# EAGLE design ospi160 (EAGLE 9.6.2)
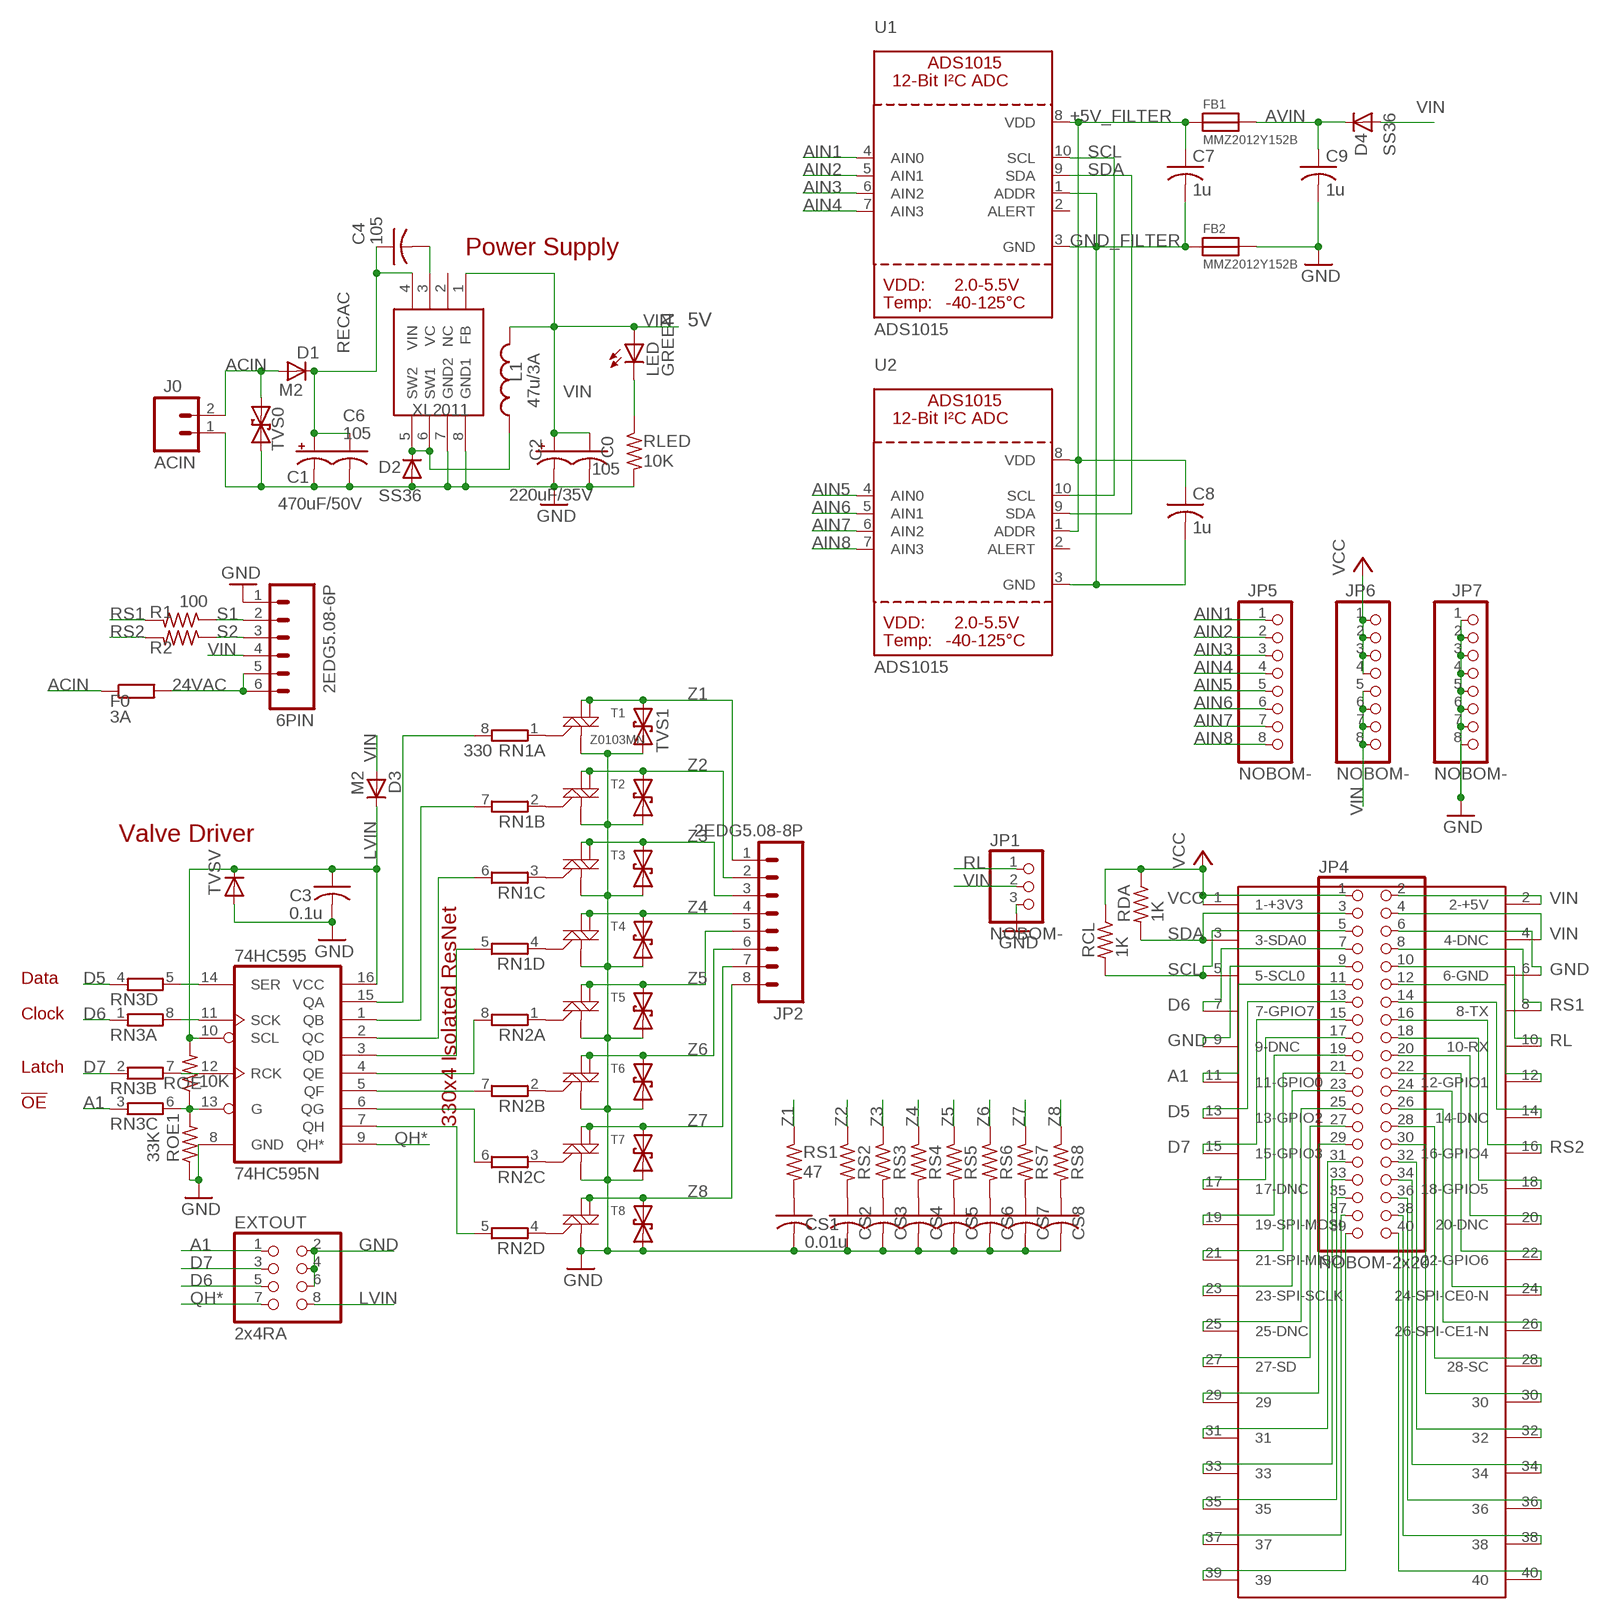
[diagram p0: schematic, sheet 1]

## Parts
6PIN  2EDG5.08-6P  M065MM  [SCREWTERMINAL-5MM-6]
74HC595  74HC595N  74LS595D  [SO16]
C0  105  C-USC0603K  [C0603K]
C1  470uF/50V  CPOL-USE5-10.5  [E5-10,5]
C2  220uF/35V  CPOL-USE3.5-8  [E3,5-8]
C3  0.1u  C-USC0603K  [C0603K]
C4  105  C-USC0603K  [C0603K]
C6  105  C-USC0603K  [C0603K]
C7  1u  C-USC0603K  [C0603K]
C8  1u  C-USC0603K  [C0603K]
C9  1u  C-USC0603K  [C0603K]
CS1  0.01u  C-USC0603K  [C0603K]
CS2  0.01u  C-USC0603K  [C0603K]
CS3  0.01u  C-USC0603K  [C0603K]
CS4  0.01u  C-USC0603K  [C0603K]
CS5  0.01u  C-USC0603K  [C0603K]
CS6  0.01u  C-USC0603K  [C0603K]
CS7  0.01u  C-USC0603K  [C0603K]
CS8  0.01u  C-USC0603K  [C0603K]
D1  M2  DIODE-DO-214AC  [DO-214AC]
D2  SS36  DIODE-SMB  [SMB]
D3  M2  DIODE-DO-214AC  [DO-214AC]
D4  SS36  DIODE-SMB  [SMB]
EXTOUT  2x4RA  PINHD-2X4/90  [2X04/90]
F0  3A  R-EU_0207/15  [0207/15]
FB1  MMZ2012Y152B  FERRITE0805  [0805]
FB2  MMZ2012Y152B  FERRITE0805  [0805]
J0  ACIN  M024MM-X  [SCREWTERMINAL-4MM-2-X]
JP1  NOBOM-  PINHD-1X3  [1X03]
JP2  2EDG5.08-8P  M085MM-8  [SCREWTERMINAL-5MM-8]
JP4  NOBOM-2x20  PINHD-2X20  [2X20]
JP5  NOBOM-  PINHD-1X8CLEANBIG  [1X08-CLEANBIG]
JP6  NOBOM-  PINHD-1X8CLEANBIG  [1X08-CLEANBIG]
JP7  NOBOM-  PINHD-1X8CLEANBIG  [1X08-CLEANBIG]
L1  47u/3A  INDUCTORYT1014  [YT1014]
LED  GREEN  LEDCHIPLED_0805  [CHIPLED_0805]
R1  100  R-US_R0603  [R0603]
R2  100  R-US_R0603  [R0603]
RCL  1K  R-US_R0603  [R0603]
RDA  1K  R-US_R0603  [R0603]
RLED  10K  R-US_R0603  [R0603]
RN1  330  4R-NEXB38V  [EXB38V]
RN2  330  4R-NEXB38V  [EXB38V]
RN3  330  4R-NEXB38V  [EXB38V]
ROE  10K  R-US_R0603  [R0603]
ROE1  33K  R-US_R0603  [R0603]
RPI  RPIB+B+  [RPIB+]
RS1  47  R-US_R0603  [R0603]
RS2  47  R-US_R0603  [R0603]
RS3  47  R-US_R0603  [R0603]
RS4  47  R-US_R0603  [R0603]
RS5  47  R-US_R0603  [R0603]
RS6  47  R-US_R0603  [R0603]
RS7  47  R-US_R0603  [R0603]
RS8  47  R-US_R0603  [R0603]
T1  Z0103MN  MAC97SOT223  [SOT223]
T2  Z0103MN  MAC97SOT223  [SOT223]
T3  Z0103MN  MAC97SOT223  [SOT223]
T4  Z0103MN  MAC97SOT223  [SOT223]
T5  Z0103MN  MAC97SOT223  [SOT223]
T6  Z0103MN  MAC97SOT223  [SOT223]
T7  Z0103MN  MAC97SOT223  [SOT223]
T8  Z0103MN  MAC97SOT223  [SOT223]
TVS0  TVSSMB  [SMB]
TVS1  SMBJ43CA  TVSSMB  [SMB]
TVS2  SMBJ43CA  TVSSMB  [SMB]
TVS3  SMBJ43CA  TVSSMB  [SMB]
TVS4  SMBJ43CA  TVSSMB  [SMB]
TVS5  SMBJ43CA  TVSSMB  [SMB]
TVS6  SMBJ43CA  TVSSMB  [SMB]
TVS7  SMBJ43CA  TVSSMB  [SMB]
TVS8  SMBJ43CA  TVSSMB  [SMB]
TVSV  SMBJ5.0A  DIODESMA-ALT  [SMA-DIODE_ALT]
U1  ADS1015  ADC_ADS1015  [MSOP10]
U2  ADS1015  ADC_ADS1015  [MSOP10]
XL2011  XL2011  XL2001  [SO08]

## Nets
24VAC [power]: 6PIN.5 6PIN.6 F0.2
+5V_FILTER [power]: C7.1 C8.1 FB1.1 U1.8(VDD) U2.1(ADDR) U2.8(VDD)
A1: EXTOUT.1 JP4.11 RN3.3 RPI.11(11-GPIO0)
ACIN [power]: D1.A F0.1 J0.2 TVS0.C
AIN1: JP5.1 U1.4(AIN0)
AIN2: JP5.2 U1.5(AIN1)
AIN3: JP5.3 U1.6(AIN2)
AIN4: JP5.4 U1.7(AIN3)
AIN5: JP5.5 U2.4(AIN0)
AIN6: JP5.6 U2.5(AIN1)
AIN7: JP5.7 U2.6(AIN2)
AIN8: JP5.8 U2.7(AIN3)
AVIN [power]: C9.1 D4.C FB1.2
D5: JP4.13 RN3.4 RPI.13(13-GPIO2)
D6: EXTOUT.5 JP4.7 RN3.1 RPI.7(7-GPIO7)
D7: EXTOUT.3 JP4.15 RN3.2 RPI.15(15-GPIO3)
GND [power]: 6PIN.1 74HC595.8(GND) C0.2 C1.- C2.- C3.2 C6.2 C9.2 CS1.2 CS2.2 CS3.2 CS4.2 CS5.2 CS6.2 CS7.2 CS8.2 D2.A EXTOUT.2 EXTOUT.4 EXTOUT.6 FB2.2 J0.1 JP1.3 JP4.6 JP4.9 JP7.1 JP7.2 JP7.3 JP7.4 JP7.5 JP7.6 JP7.7 JP7.8 RLED.2 ROE1.1 RPI.6(6-GND) RPI.9(9-DNC) T1.1(M1) T2.1(M1) T3.1(M1) T4.1(M1) T5.1(M1) T6.1(M1) T7.1(M1) T8.1(M1) TVS0.A TVS1.C TVS2.C TVS3.C TVS4.C TVS5.C TVS6.C TVS7.C TVS8.C TVSV.A XL2011.7(GND2) XL2011.8(GND1)
GND_FILTER [power]: C7.2 C8.2 FB2.1 U1.1(ADDR) U1.3(GND) U2.3(GND)
LVIN [power]: 74HC595.10(SCL) 74HC595.16(VCC) C3.1 D3.C EXTOUT.8 ROE.2 TVSV.C
N$1: LED.C RLED.1
N$3: RN1.1 T1.3(G)
N$4: 74HC595.5(QF) RN2.7
N$5: 74HC595.6(QG) RN2.6
N$6: RN1.2 T2.3(G)
N$7: 74HC595.7(QH) RN2.5
N$8: CS1.1 RS1.2
N$9: CS2.1 RS2.2
N$10: 74HC595.4(QE) RN2.8
N$11: 74HC595.3(QD) RN1.5
N$12: 74HC595.2(QC) RN1.6
N$13: 74HC595.1(QB) RN1.7
N$14: 74HC595.15(QA) RN1.8
N$15: RN1.3 T3.3(G)
N$16: CS3.1 RS3.2
N$17: CS4.1 RS4.2
N$18: CS5.1 RS5.2
N$19: RN1.4 T4.3(G)
N$20: CS6.1 RS6.2
N$21: RN2.1 T5.3(G)
N$22: CS7.1 RS7.2
N$23: CS8.1 RS8.2
N$24: D2.C L1.P$1 XL2011.5(SW2) XL2011.6(SW1)
N$25: C4.2 XL2011.3(VC)
N$26: RN2.2 T6.3(G)
N$27: RN2.3 T7.3(G)
N$28: RN2.4 T8.3(G)
N$33: 74HC595.14(SER) RN3.5
N$34: 74HC595.11(SCK) RN3.8
N$35: 74HC595.12(RCK) RN3.7
N$37: JP4.12 RPI.12(12-GPIO1)
N$38: JP4.14 RPI.14(14-DNC)
N$40: 74HC595.13(G) RN3.6 ROE1.2 ROE.1
N$41: JP4.23 RPI.23(23-SPI-SCLK)
N$42: JP4.25 RPI.25(25-DNC)
N$43: JP4.27 RPI.27(27-SD)
N$44: JP4.29 RPI.29
N$45: JP4.39 RPI.39
N$46: JP4.37 RPI.37
N$47: JP4.17 RPI.17(17-DNC)
N$48: JP4.19 RPI.19(19-SPI-MOSI)
N$49: JP4.21 RPI.21(21-SPI-MISO)
N$50: JP4.35 RPI.35
N$51: JP4.33 RPI.33
N$52: JP4.31 RPI.31
N$53: JP4.34 RPI.34
N$54: JP4.36 RPI.36
N$55: JP4.38 RPI.38
N$56: JP4.40 RPI.40
N$59: JP4.18 RPI.18(18-GPIO5)
N$60: JP4.20 RPI.20(20-DNC)
N$61: JP4.22 RPI.22(22-GPIO6)
N$62: JP4.24 RPI.24(24-SPI-CE0-N)
N$63: JP4.26 RPI.26(26-SPI-CE1-N)
N$64: JP4.28 RPI.28(28-SC)
N$65: JP4.30 RPI.30
N$66: JP4.32 RPI.32
QH*: 74HC595.9(QH*) EXTOUT.7
RECAC [power]: C1.+ C4.1 C6.1 D1.C XL2011.4(VIN)
RL: JP1.1 JP4.10 RPI.10(10-RX)
RS1: JP4.8 R1.2 RPI.8(8-TX)
RS2: JP4.16 R2.2 RPI.16(16-GPIO4)
S1: 6PIN.2 R1.1
S2: 6PIN.3 R2.1
SCL [i2c]: JP4.5 RCL.2 RPI.5(5-SCL0) U1.10(SCL) U2.10(SCL)
SDA [i2c]: JP4.3 RDA.2 RPI.3(3-SDA0) U1.9(SDA) U2.9(SDA)
VCC: JP4.1 JP6.1 JP6.2 JP6.3 JP6.4 RCL.1 RDA.1 RPI.1(1-+3V3)
VIN [power]: 6PIN.4 C0.1 C2.+ D3.A D4.A JP1.2 JP4.2 JP4.4 JP6.5 JP6.6 JP6.7 JP6.8 L1.P$2 LED.A RPI.2(2-+5V) RPI.4(4-DNC) XL2011.1(FB)
Z1: JP2.1 RS1.1 T1.2(M2) T1.4(M2-4) TVS1.A
Z2 [power]: JP2.2 RS2.1 T2.2(M2) T2.4(M2-4) TVS2.A
Z3 [power]: JP2.3 RS3.1 T3.2(M2) T3.4(M2-4) TVS3.A
Z4 [power]: JP2.4 RS4.1 T4.2(M2) T4.4(M2-4) TVS4.A
Z5 [power]: JP2.5 RS5.1 T5.2(M2) T5.4(M2-4) TVS5.A
Z6 [power]: JP2.6 RS6.1 T6.2(M2) T6.4(M2-4) TVS6.A
Z7 [power]: JP2.7 RS7.1 T7.2(M2) T7.4(M2-4) TVS7.A
Z8 [power]: JP2.8 RS8.1 T8.2(M2) T8.4(M2-4) TVS8.A
Unconnected: U1.2(ALERT) U2.2(ALERT) XL2011.2(NC)

## Notes on the sheet
- Power Supply
- 5V
- Valve Driver
- Data
- Clock
- Latch
- !OE
- 330x4 Isolated ResNet

## Library data of the parts
6PIN = SparkFun:M06: Header 6 Standard 6-pin 0.1" header. Use with straight break away headers (SKU : PRT-00116), right angle break away headers (PRT-00553), swiss pins (PRT-00743), machine pins (PRT-00117), and female headers (PRT-00115). Molex polarized connector foot print use with SKU : PRT-08094 with associated crimp pins and housings. NOTES ON THE VARIANTS LOCK and LOCK_LONGPADS... This footprint was designed to help hold the alignment of a through-hole component (i.e. 6-pin header) while soldering it into place. You may notice that each hole has been shifted either up or down by 0.005 of an inch from it's more standard position (which is a perfectly straight line). This slight alteration caused the pins (the squares in the middle) to touch the edges of the holes. Because they are alternating, it causes a "brace" to hold the component in place. 0.005 has proven to be the perfect amount of "off-center" position when using our standard breakaway headers. Although looks a little odd when you look at the bare footprint, once you have a header in there, the alteration is very hard to notice. Also, if you push a header all the way into place, it is covered up entirely on the bottom side. This idea of altering the position of holes to aid alignment will be further integrated into the Sparkfun Library for other footprints. It can help hold any component with 3 or more connection pins.
74HC595 = SparkFun:74*595: 8-bit SHIFT REGISTER, output latch
C0 C3 C4 C6 CS1-CS8 = adafruit:C-US: CAPACITOR, American symbol
C1 C2 = adafruit:CPOL-US: POLARIZED CAPACITOR, American symbol
C7-C9 = adafruit2013:C-US: CAPACITOR, American symbol
D1-D4 = diode:DIODE-: DIODE
EXTOUT = pinhead:PINHD-2X4: PIN HEADER
F0 = rcl:R-EU_: RESISTOR, European symbol; SPICEPREFIX: R
FB1 FB2 = microbuilder:FERRITE: Ferrite Bead 0603 MMZ1608B121C - 120 Ohm, 600mA Ferrite Chip - Digikey: 445-2164-1-ND BK1608HW121-T - 120 Ohm, 600mA Ferrite Chip - Digikey: 587-1876-2-ND 0805 HZ0805B272R-10 - 2.7K Ohm @ 100MHz, 200mA 0.8 Ohm DC Resistance - Digikey: 240-2504-1-ND (see also Murata BLM21BD272SN1L)
J0 = SparkFun:M02: Header 2 Standard 2-pin 0.1" header. Use with straight break away headers (SKU : PRT-00116), right angle break away headers (PRT-00553), swiss pins (PRT-00743), machine pins (PRT-00117), and female headers (PRT-00115). Molex polarized connector foot print use with SKU : PRT-08233 with associated crimp pins and housings.
JP1 = pinhead:PINHD-1X3: PIN HEADER
JP2 = SparkFun:M08: Header 8 Standard 8-pin 0.1" header. Use with straight break away headers (SKU : PRT-00116), right angle break away headers (PRT-00553), swiss pins (PRT-00743), machine pins (PRT-00117), and female headers (PRT-00115).
JP4 = adafruit_3:PINHD-2X20: PIN HEADER
JP5-JP7 = adafruit:PINHD-1X8: PIN HEADER
L1 = SparkFunNew:INDUCTOR: Inductors Basic Inductor/Choke - 0603 and 1206. Footprints are not proven and vary greatly between part numbers.
LED = adafruit:LED: LED OSRAM: - CHIPLED LG R971, LG N971, LY N971, LG Q971, LY Q971, LO R971, LY R971 LH N974, LH R974 LS Q976, LO Q976, LY Q976 LO Q996 - Hyper CHIPLED LW Q18S LB Q993, LB Q99A, LB R99A - SideLED LS A670, LO A670, LY A670, LG A670, LP A670 LB A673, LV A673, LT A673, LW A673 LH A674 LY A675 LS A676, LA A676, LO A676, LY A676, LW A676 LS A679, LY A679, LG A679 - Hyper Micro SIDELED® LS Y876, LA Y876, LO Y876, LY Y876 LT Y87S - SmartLED LW L88C, LW L88S LB L89C, LB L89S, LG L890 LS L89K, LO L89K, LY L89K LS L896, LA L896, LO L896, LY L896 - TOPLED LS T670, LO T670, LY T670, LG T670, LP T670 LSG T670, LSP T670, LSY T670, LOP T670, LYG T670 LG T671, LOG T671, LSG T671 LB T673, LV T673, LT T673, LW T673 LH T674 LS T676, LA T676, LO T676, LY T676, LB T676, LH T676, LSB T676, LW T676 LB T67C, LV T67C, LT T67C, LS T67K, LO T67K, LY T67K, LW E67C LS E67B, LA E67B, LO E67B, LY E67B, LB E67C, LV E67C, LT E67C LW T67C LS T679, LY T679, LG T679 LS T770, LO T770, LY T770, LG T770, LP T770 LB T773, LV T773, LT T773, LW T773 LH T774 LS E675, LA E675, LY E675, LS T675 LS T776, LA T776, LO T776, LY T776, LB T776 LHGB T686 LT T68C, LB T68C - Hyper Mini TOPLED® LB M676 - Mini TOPLED Santana® LG M470 LS M47K, LO M47K, LY M47K Source: http://www.osram.convergy.de/
R1 R2 RCL RDA RLED ROE ROE1 RS1-RS8 = adafruit2013:R-US_: RESISTOR, American symbol
RN1-RN3 = resistor-net:4R-N: Array Chip Resistor Source: RS Component / Phycomp; OC_FARNELL: unknown; OC_NEWARK: unknown
RPI = RaspberryPi:RPIB+
T1-T8 = SparkFun:MAC97: MAC97 Triac http://www.onsemi.com/pub_link/Collateral/MAC97-D.PDF
TVS0 TVS1-TVS8 = SparkFunNew:TVS
TVSV = SparkFunNew:DIODE: Diode These are standard reverse protection diodes and small signal diodes. SMA package can handle up to about 1A. SOD-323 can handle about 200mA. What the SOD-323 package when ordering, there are some mfgs out there that are 5-pin packages.
U1 U2 = microbuilder:ADC_ADS1015: ADS1015 - 12-bit 4-Channel I2C ADC with Internal PGA VDD: 2.0-5.5V Sampling Rate: 3.3ksps Gain Settings: 2/3, 1, 2, 4, 8, 16 I2C Address: ADDR low = 1001000x, ADDR high = 1001001x Internal Comparator The ADS1015 includes an internal comparator that can be set to output a high-level on ALERT when the conversion results exceeeds a pre-defined upper level, and will deassert itself when the level falls below a pre-defined lower threshold level. It can also be set to windowed mode where the ALERT pin will be asserted if the data exceeds the upper threshold or falls below the lower threshold.
XL2011 = adafruit:XL2001

## Net classes
0 default: width 0.178 mm
1 power: width 0.254 mm
2 relay power: width 0.254 mm
3 i2c: width 0.203 mm

## Board
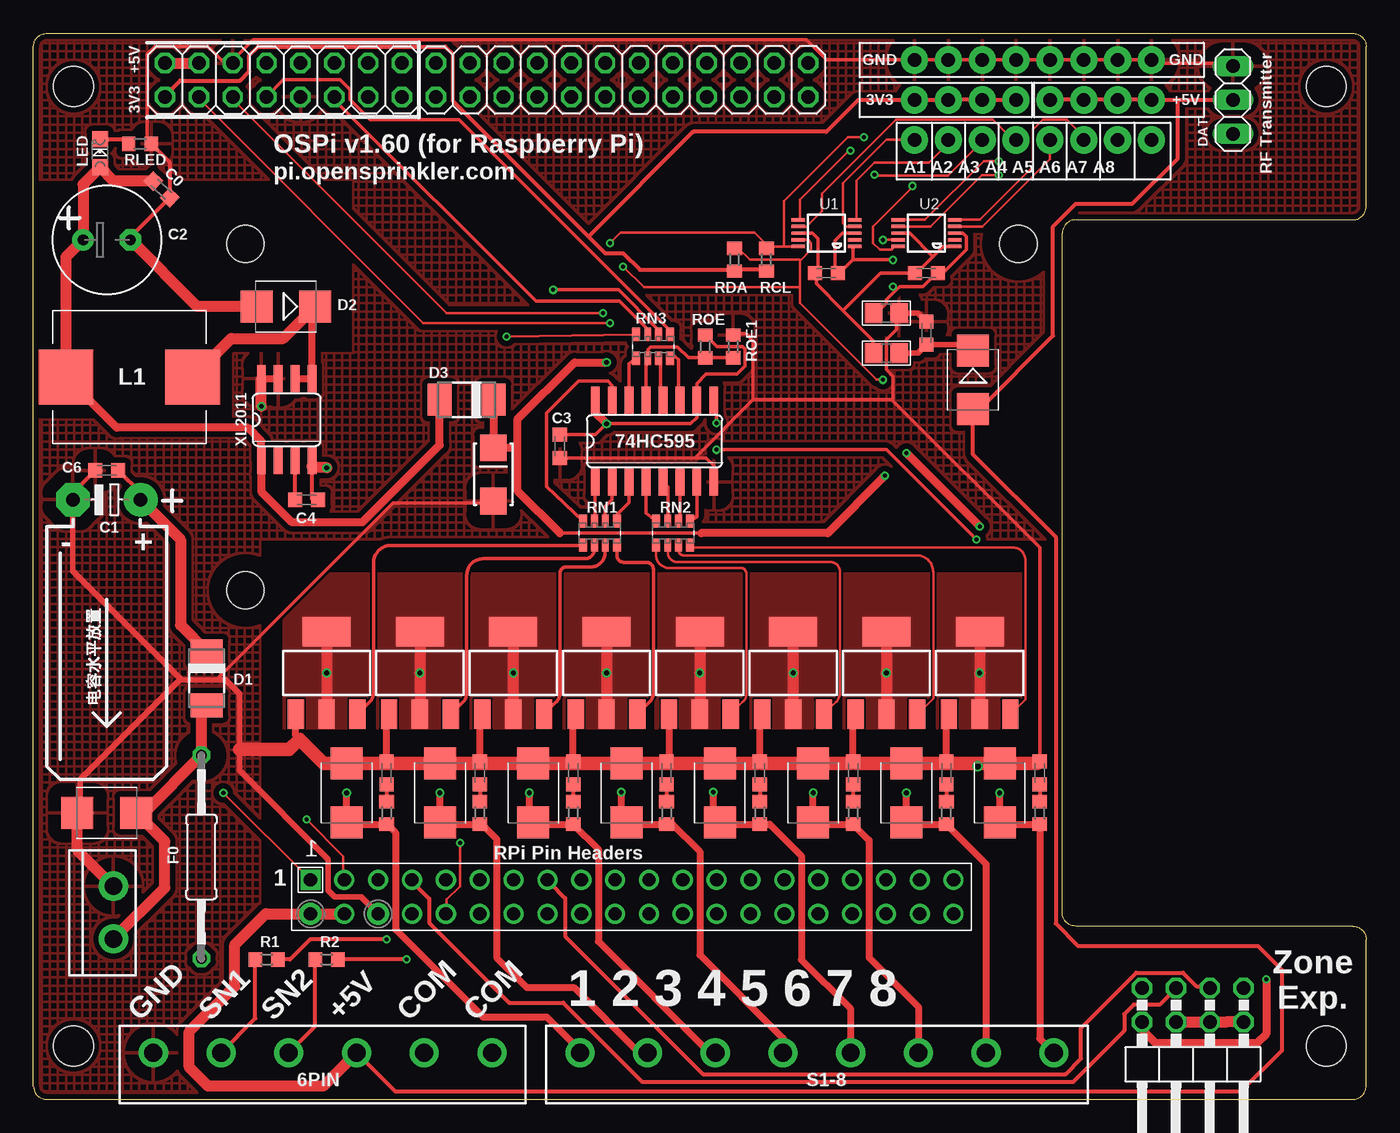
[diagram p1: board, top side]
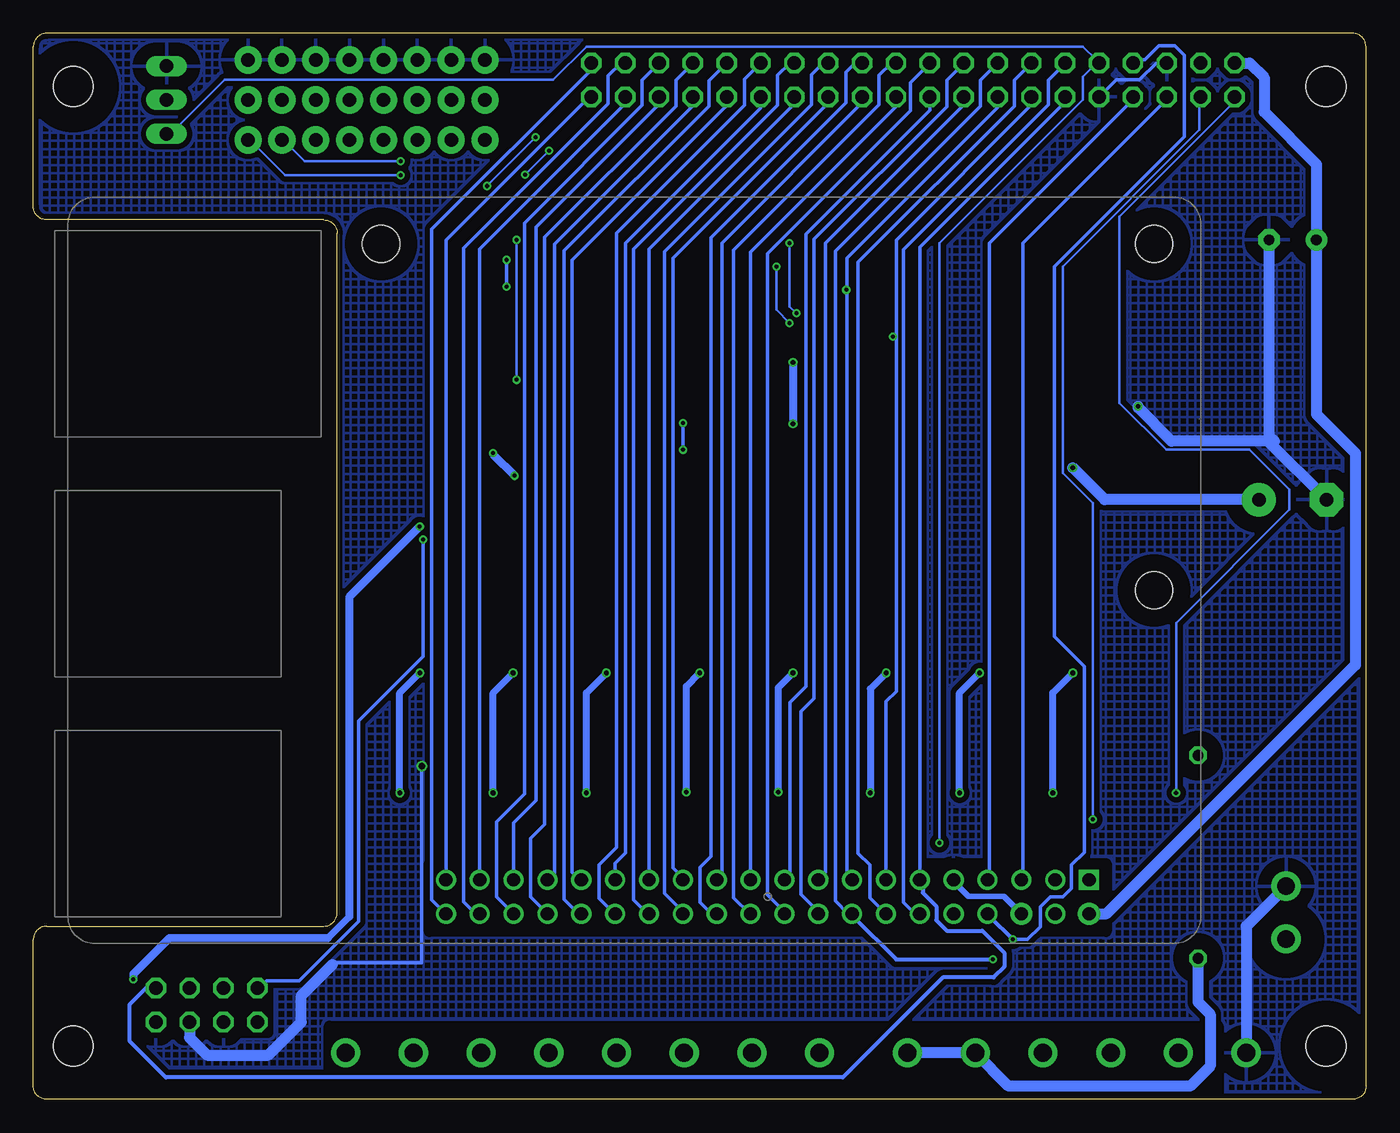
[diagram p2: board, bottom side, seen from below]

Size 100 x 80 mm. Coordinates in mm from the lower left corner, seen from the top.
Outline: 9.5,0 94.5,0 99,0 arc90 100,1 100,12 arc90 99,13 78.2,13 arc-90 77.2,14 77.2,65 arc-90 78.2,66 99,66 arc90 100,67 100,79 arc90 99,80 1,80 arc90 0,79 0,1 arc90 1,0 9.5,0
Copper layers (1*16): Top 0.035mm / dielectric 1.5mm / Bottom 0.035mm
Design rules "Fusion_eagle_rule_v1.1 *": minimum track width 6mil, minimum drill 12mil, track to track 6mil, track to pad 6mil, pad to pad 6mil, via to via 6mil, smd to smd 0mil, copper to edge 10mil, drill to drill 10mil, minimum pad ring 10mil, minimum via ring 6mil, stop-mask expansion 2mil, vias tented up to drill 100mil, thermal gap 40mil
Holes 3 mm at 3,76 97,76 3,4 97,4
tRestrict: area 71.6,61.9 to 76.2,66.5; area 13.6,61.9 to 18.2,66.5; area 13.6,35.9 to 18.2,40.5; area 11.2,24.4 to 14,27.2
bRestrict: area 13.6,61.9 to 18.2,66.5; area 71.6,61.9 to 76.2,66.5; area 13.6,35.9 to 18.2,40.5; area 11.1,0 to 77.8,5.5; area 2.1,62.9 to 5.3,66.1; area 6,42.9 to 10.2,47.1; area 3.5,9.5 to 8.5,14.5; area 19.5,12.6 to 70.3,17.7; area 11.2,24.4 to 14,27.2; area 11.2,9.2 to 14,12; area 82.4,5 to 91.7,9.2; area 0,1 to 6,7; 3 more areas

### Footprints (pad centres in the part's own frame; a part is rotated, then mirrored left to right if it is on the bottom)
SCREWTERMINAL-5MM-6 = drill 1.35 pad 2.184: 1 -12.7,0; 2 -7.62,0; 3 -2.54,0; 4 2.54,0; 5 7.62,0; 6 12.7,0
SO16 = smd 0.66 x 2.032: 1 -4.445,-3.073; 2 -3.175,-3.073; 3 -1.905,-3.073; 4 -0.635,-3.073; 5 0.635,-3.073; 6 1.905,-3.073; 7 3.175,-3.073; 8 4.445,-3.073; 9 4.445,3.073; 10 3.175,3.073; 11 1.905,3.073; 12 0.635,3.073; 13 -0.635,3.073; 14 -1.905,3.073; 15 -3.175,3.073; 16 -4.445,3.073
C0603K = smd 1.05 x 1.08: 1 -0.875,0; 2 0.875,0
E5-10,5 = drill 1.016 pad 2.54: + -2.54,0 | drill 1.016 pad 2.54 octagon: - 2.54,0
E3,5-8 = drill 0.813 pad 1.6: + -1.778,0 | drill 0.813 pad 1.6 octagon: - 1.778,0
DO-214AC = smd 1.8 x 2.4: A 2.025,0; C -2.025,0
SMB = smd 2.4 x 2.4: A 2.2,0; C -2.2,0
2X04/90 = drill 1.016 octagon: 1 -3.81,-6.35; 2 -3.81,-3.81; 3 -1.27,-6.35; 4 -1.27,-3.81; 5 1.27,-6.35; 6 1.27,-3.81; 7 3.81,-6.35; 8 3.81,-3.81
0207/15 = drill 0.813 octagon: 1 -7.62,0; 2 7.62,0
0805 = smd 1.3 x 1.5: 1 -0.95,0; 2 0.95,0
SCREWTERMINAL-4MM-2-X = drill 1.3 pad 2.184: 1 -1.98,0; 2 1.98,0
1X03 = drill 1.016 long: 1 -2.54,0; 2 0,0; 3 2.54,0
SCREWTERMINAL-5MM-8 = drill 1.35 pad 2.184: 1 -17.78,0; 2 -12.7,0; 3 -7.62,0; 4 -2.54,0; 5 2.54,0; 6 7.62,0; 7 12.7,0; 8 17.78,0
2X20 = drill 1.016 octagon: 1 -24.13,-1.27; 2 -24.13,1.27; 3 -21.59,-1.27; 4 -21.59,1.27; 5 -19.05,-1.27; 6 -19.05,1.27; 7 -16.51,-1.27; 8 -16.51,1.27; 9 -13.97,-1.27; 10 -13.97,1.27; 11 -11.43,-1.27; 12 -11.43,1.27; 13 -8.89,-1.27; 14 -8.89,1.27; 15 -6.35,-1.27; 16 -6.35,1.27; 17 -3.81,-1.27; 18 -3.81,1.27; 19 -1.27,-1.27; 20 -1.27,1.27; 21 1.27,-1.27; 22 1.27,1.27; 23 3.81,-1.27; 24 3.81,1.27; 25 6.35,-1.27; 26 6.35,1.27; 27 8.89,-1.27; 28 8.89,1.27; 29 11.43,-1.27; 30 11.43,1.27; 31 13.97,-1.27; 32 13.97,1.27; 33 16.51,-1.27; 34 16.51,1.27; 35 19.05,-1.27; 36 19.05,1.27; 37 21.59,-1.27; 38 21.59,1.27; 39 24.13,-1.27; 40 24.13,1.27
1X08-CLEANBIG = drill 1.016 pad 2.032: 1 -8.89,0; 2 -6.35,0; 3 -3.81,0; 4 -1.27,0; 5 1.27,0; 6 3.81,0; 7 6.35,0; 8 8.89,0
YT1014 = smd 4.1 x 4.1: P$1 -4.75,0; P$2 4.75,0
CHIPLED_0805 = smd 1.2 x 1.2: A 1.05,0; C -1.05,0
R0603 = smd 1 x 1.1: 1 -0.85,0; 2 0.85,0
EXB38V = smd 0.6 x 1: 1 -1.275,-0.9; 4 1.275,-0.9; 5 1.275,0.9; 8 -1.275,0.9 | smd 0.5 x 1: 2 -0.4,-0.9; 3 0.4,-0.9; 6 0.4,0.9; 7 -0.4,0.9
RPIB+ = drill 1 square: 1 8.382,51.232 | drill 1 pad 1.676: 2 8.382,53.772; 6 13.462,53.772 | drill 1: 3 10.922,51.232; 4 10.922,53.772; 5 13.462,51.232; 7 16.002,51.232; 8 16.002,53.772; 9 18.542,51.232; 10 18.542,53.772; 11 21.082,51.232; 12 21.082,53.772; 13 23.622,51.232; 14 23.622,53.772; 15 26.162,51.232; 16 26.162,53.772; 17 28.702,51.232; 18 28.702,53.772; 19 31.242,51.232; 20 31.242,53.772; 21 33.782,51.232; 22 33.782,53.772; 23 36.322,51.232; 24 36.322,53.772; 25 38.862,51.232; 26 38.862,53.772; 27 41.402,51.232; 28 41.402,53.772; 29 43.942,51.232; 30 43.942,53.772; 31 46.482,51.232; 32 46.482,53.772; 33 49.022,51.232; 34 49.022,53.772; 35 51.562,51.232; 36 51.562,53.772; 37 54.102,51.232; 38 54.102,53.772; 39 56.642,51.232; 40 56.642,53.772 | hole 2.8: 3.5,3.5; 61.5,3.5; 3.5,29.5
SOT223 = smd 2.235 x 1.219: 1 3.099,-2.311; 2 3.099,0; 3 3.099,2.311 | smd 2.2 x 3.6: 4 -3.099,0
SMA-DIODE_ALT = smd 2 x 2: A 2,0; C -2,0
MSOP10 = smd 0.25 x 1: 1 -1,-2.113; 2 -0.5,-2.113; 3 0,-2.113; 4 0.5,-2.113; 5 1,-2.113; 6 1,2.113; 7 0.5,2.113; 8 0,2.113; 9 -0.5,2.113; 10 -1,2.113
SO08 = smd 0.66 x 2.032: 1 -1.905,-3.073; 2 -0.635,-3.073; 3 0.635,-3.073; 4 1.905,-3.073; 5 1.905,3.073; 6 0.635,3.073; 7 -0.635,3.073; 8 -1.905,3.073

### Placement (x,y rotation side)
6PIN  21.7,3.5 0 top
74HC595  46.6,49.4 0 top
C0  9.6,68.3 315 top
C1  5.5,45 180 top
C2  5.5,64.5 0 top
C3  39.5,49 270 top
C4  20.5,45 180 top
C6  5.5,47.2 180 top
C7  59.5,62 0 top
C8  67,62 0 top
C9  67,57.5 90 top
CS1  26.5,24.5 90 top
CS2  33.5,24.5 90 top
CS3  40.5,24.5 90 top
CS4  47.5,24.5 90 top
CS5  54.5,24.5 90 top
CS6  61.5,24.5 90 top
CS7  68.5,24.5 90 top
CS8  75.5,24.5 90 top
D1  13,31.6 270 top
D2  18.95,59.5 180 top
D3  32.5,52.5 180 top
D4  70.5,54 270 top
EXTOUT  87,2 180 top
F0  12.6,18.2 270 top
FB1  64,56 0 top
FB2  64,59 0 top
J0  6,14.02 270 top
JP1  90,75 90 top
JP2  58.78,3.5 0 top
JP4  34,76.5 0 top
JP5  75,72 0 top
JP6  75,75 0 top
JP7  75,78 0 top
L1  7.2,54.2 180 top
LED  5,71 270 top
R1  17.5,10.5 0 top
R2  22,10.5 0 top
RCL  55,63 90 top
RDA  52.6,63 90 top
RLED  8,71.7 0 top
RN1  42.5,42.5 0 top
RN2  48,42.5 0 top
RN3  46.5,56.5 180 top
ROE  50.4,56.5 90 top
ROE1  52.5,56.5 270 top
RPI  12.4,67.7 180 bottom
RS1  26.5,21.5 90 top
RS2  33.5,21.5 90 top
RS3  40.5,21.5 90 top
RS4  47.5,21.5 90 top
RS5  54.5,21.5 90 top
RS6  61.5,21.5 90 top
RS7  68.5,21.5 90 top
RS8  75.5,21.5 90 top
T1  22,32 270 top
T2  29,32 270 top
T3  36,32 270 top
T4  43,32 270 top
T5  50,32 270 top
T6  57,32 270 top
T7  64,32 270 top
T8  71,32 270 top
TVS0  5.5,21.5 180 top
TVS1  23.5,23 270 top
TVS2  30.5,23 270 top
TVS3  37.5,23 270 top
TVS4  44.5,23 270 top
TVS5  51.5,23 270 top
TVS6  58.5,23 270 top
TVS7  65.5,23 270 top
TVS8  72.5,23 270 top
TVSV  34.5,46.9 270 top
U1  59.5,65 90 top
U2  67,65 90 top
XL2011  19,51 0 top

### Tracks (layer width: path | path; a pad name or v marks a point on that pad's centre or on a via)
24VAC
  Bottom 0.813: 6PIN.6 6PIN.5 26.82,1 13.2,1 11.7,2.5 11.7,6.4 12.6,7.3 F0.2
+5V_FILTER
  Top 0.254: U2.1 68.25,64 67.5,63.25 | 67.5,63.25 66.25,62 C8.1 63.55,62 60.75,59.2 | U2.8 65.75,65 67.5,63.25 | U1.8 58.45,65 58.85,64.6 58.85,62 58.75,62 | 60.75,59.2 58.75,61.2 58.75,62 | 60.75,59.2 63,56.95 63,56 FB1.1 | 58.75,62 C7.1
A1
  Top 0.254: RN3.3 46.1,57.76 43.96,59.9 37.7,59.9 22.57,75.03 JP4.11
  Bottom 0.254: JP4.11 22.57,74.88 33.48,63.97 RPI.11 33.25,16.25
  Bottom 0.305: 33.25,16.25 33.25,15.5 32.25,14.5 32.25,13.45 31.45,12.65 28.8,12.65 27.15,11 27.15,9.95 27.95,9.15 31.75,9.15 39.25,1.65 90.05,1.65 92.75,4.35 92.75,7.15 91.55,8.35 EXTOUT.1
ACIN
  Top 0.813: D1.A 12.6,29.18 F0.1 12.6,25.8 8.3,21.5 TVS0.C 9.85,19.35 9.85,15.89 J0.2
AIN1
  Top 0.178: U1.4 61,65.5 60.75,65.75 60.75,68.75 64,72 JP5.1
AIN2
  Top 0.178: JP5.2 68.65,71.75 67.2,70.3 63.1,70.3 61.75,68.95 61.75,66 U1.5
AIN3  (via drill 0.3)
  Top 0.178: v61.3,71.2 61.2,71.2 57.5,67.5 57.5,66 U1.6 | v63.1,69.4 63.2,69.3 68.6,69.3 71.19,71.89 JP5.3
  Bottom 0.178: v63.1,69.4 v61.3,71.2
AIN4
  Top 0.178: U1.7 58,65.5 59.15,66.65 59.15,67.95 64.7,73.5 72,73.5 73.5,72 JP5.4
AIN5
  Top 0.178: U2.4 71.2,65.5 76.25,70.55 76.25,72 JP5.5
AIN6
  Top 0.178: U2.5 71,66 75,70 75,72.75 75.75,73.5 77.55,73.5 78.81,72.24 JP5.6
AIN7  (via drill 0.3)
  Top 0.178: U2.6 66.9,66 71.3,70.4 v72.45,70.4
  Bottom 0.178: v72.45,70.4 79.65,70.4 81.25,72 JP5.7
AIN8  (via drill 0.3)
  Top 0.178: U2.7 67.3,65.5 71.15,69.35 v72.45,69.35
  Bottom 0.178: v72.45,69.35 81.1,69.35 83.75,72 JP5.8
AVIN
  Top 0.406: D4.C 70.08,56.62 C9.1 66.38,56 FB1.2
D5  (via drill 0.3)
  Top 0.178: v35.5,57.25 RN3.4
  Bottom 0.178: 35.24,57.25 v35.5,57.25
  Bottom 0.254: RPI.13 36.02,29.85 35.24,30.63 35.24,57.25 35.24,64.5 25.11,74.63 JP4.13
D6
  Top 0.178: 47.73,57.13 RN3.1 | 17.5,75.25 JP4.7 | 28.5,16.25 RPI.7
  Top 0.254: 47.73,57.13 47.73,57.71 31.94,73.5 25.25,73.5 23.75,75 23.75,75.75 23,76.5 18.75,76.5 17.5,75.25
  Top 0.305: EXTOUT.5 85.73,8.33 84.5,7.1 82.55,7.1 81.85,6.4 81.85,5.15 78,1.3 45.7,1.3 39.75,7.25 35.7,7.25 29.7,13.25 29.7,15.05 28.5,16.25
  Bottom 0.178: 28.25,16.5 RPI.7
  Bottom 0.254: 28.25,16.5 28.25,64.25 17.5,75 JP4.7
D7  (via drill 0.3)
  Top 0.178: 38.75,16.25 RPI.15
  Top 0.254: v39,60.75 43.89,60.75 46.75,57.89 46.75,57.25 RN3.2
  Top 0.305: 38.75,16.25 39.9,15.1 39.9,12.25 50.25,1.9 77.45,1.9 78.6,3.05 78.6,5.35 82.75,9.5 86.25,9.5 87.25,8.5 88.25,8.5 EXTOUT.3
  Bottom 0.178: v39,60.75 38.96,60.75
  Bottom 0.254: RPI.15 38.96,16.87 38.96,60.75 38.96,63.12 27.65,74.43 JP4.15
GND  (via drill 0.35, 0.5)
  Top 0.254: C3.2 49.75,48.12 | 49.75,48.12 50.48,48.12 51.05,47.55 74HC595.8 | ROE1.1 52.6,57.45 53.45,57.45 54,56.9 54,52.5 | 54,52.5 49.75,48.25 49.75,48.12 | 54,52.5 64.4,52.5 64.45,52.45 | RLED.2 8.55,71.85 8.55,78.45 9.1,79 13.1,79 14.15,77.95 14.79,77.95 JP4.6 15,78 16.5,79.5 58,79.5 59.5,78 JP7.1 JP7.2 JP7.3 JP7.4 JP7.5 JP7.6 JP7.7 JP7.8 84,78 84.25,77.75 90,77.75 JP1.3 | v70.85,25 70.85,25.2 | 3.5,21.75 TVS0.A | 11,31.5 11.12,31.48 | 64.45,52.45 75.5,41.4 CS8.2 | TVSV.A 34.5,44.75 27,44.75 13.75,31.5 13.75,31.48 | FB2.2 64.75,59 64.75,57.75 64,57 64,54.75 64.5,54.25 64.5,52.5 64.45,52.45
  Top 0.305: C2.- 7.28,64.74 C0.2 10.22,70.33 RLED.2 | C6.2 2.98,45.55 2.96,45.55 C1.-
  Top 0.406: RPI.6 24.58,15.21 22.59,15.21 22.11,15.69 22.11,18.03 15.46,24.68 15.46,26.25 15.46,30.44 14.42,31.48 13.75,31.48 11.12,31.48 2.96,39.64 2.96,45.55 | 3.5,21.75 3.5,24 11,31.5 | FB2.2 66.38,59 C9.2
  Top 0.508: XL2011.8 XL2011.7 | 26.32,25.2 CS1.2 26.5,28.71 T2.1 | 33.33,25.2 CS2.2 33.5,28.71 T3.1 | 40.33,25.2 CS3.2 40.5,28.71 T4.1 | 47.33,25.2 CS4.2 47.69,25.56 T5.1 | 54.33,25.2 CS5.2 54.5,28.71 T6.1 | 61.33,25.2 CS6.2 | 61.67,25.2 CS6.2 | 68.33,25.2 CS7.2 68.5,28.71 T8.1 | 75.33,25.2 CS8.2 | 19.97,27.02 19.69,27.29 T1.1 | CS6.2 61.5,28.71 T7.1
  Top 0.813: J0.1 3.3,18.7 TVS0.A | v17.1,52 XL2011.8 | D2.A 12.28,59.5 C2.- | EXTOUT.6 EXTOUT.4 89.5,5.81 | EXTOUT.2 89.5,5.81 | 89.5,5.81
  Top 1.016: 54.33,25.2 TVS5.C 47.33,25.2 TVS4.C 40.33,25.2 TVS3.C 33.33,25.2 TVS2.C 26.32,25.2 TVS1.C 21.78,25.2 19.97,27.02 19.2,26.25 15.46,26.25 | CS5.2 54.67,25.2 TVS6.C 61.33,25.2 | 61.67,25.2 TVS7.C 68.33,25.2 70.85,25.2 TVS8.C 75.33,25.2
  Bottom 0.254: JP4.6 15,77.75 15.75,77.75 17,76.5 18.75,76.5 20,75.25 JP4.9 | v70.85,25 70.85,10.25 77.25,10.25 77.58,10.1
  Bottom 0.406: RPI.6 27.18,15.25 29.85,15.25 30.94,16.34 RPI.9
  Bottom 0.813: J0.1 9,13 6PIN.1 | C1.- 7.36,49.4 | 7.36,49.4 6.86,49.4 7.28,49.82 C2.- | 7.36,49.4 14.6,49.4 17.1,51.9 v17.1,52 | EXTOUT.4 88.27,4.63 86.95,3.31 82.39,3.31 79.9,5.8 79.9,7.78 77.58,10.1
  pour Bottom (isolate 0.406, hatched): 0,80 100,80 100,0 0,0
  pour Top (isolate 0.406, hatched): 0,80 100,80 100,42 17,42 17,0 0,0 0,51 15,51 15,56 24,56 24,69 0,69
GND_FILTER  (via drill 0.3)
  Top 0.254: 61.5,63 61.5,64 U1.1 | 60.75,62.25 60.5,62 C7.2 | 60.75,62.25 61.5,63 | U1.3 60.7,65 60.15,64.45 60.15,61.85 C7.2 | 60.75,62.25 60.45,62.05 C7.2 | U2.3 69.75,65 70,64.75 70,63.75 68.25,62 C8.2 67.75,62 66.75,61 65,61 64.75,60.75 | 64.75,60.75 64,60 64,59.75 63.25,59 FB2.1 | v64.5,63 61.5,63 | 64.75,60.75 v64.5,61
  Bottom 0.254: v64.5,61 v64.5,63
LVIN  (via drill 0.3, 0.35)
  Top 0.254: ROE.2 51.27,56.48 53.19,56.48 53.38,56.29 53.38,55.01 52.79,54.42 50.48,54.42 49.77,53.72 74HC595.10 49.77,51.17 49.3,50.7 v43,50.7 42.17,49.88 C3.1
  Top 0.28: 50.1,42.5 39.5,42.5
  Top 0.61: D3.C 34.52,49.23 TVSV.C 36.3,48.9 | v43,55.3 40.6,55.3 36.3,51 36.3,48.9 | v43,50.7 42.16,51.55 74HC595.16 | EXTOUT.8 83.19,5.21 84.2,4.2 91.8,4.2 92.5,4.9 v92.5,9 | v65.5,48.5 v71,43 | 50.1,42.5 59.6,42.5 v63.9,46.8 | 36.3,48.9 36.3,45.7 39.5,42.5
  Bottom 0.508: 76.3,13.7 77.9,12.1
  Bottom 0.61: v43,55.3 v43,50.7 | v92.5,9 92.5,9.4 89.8,12.1 77.9,12.1 | 76.3,13.7 76.3,37.7 v71,43 | v63.9,46.8 65.5,48.4 v65.5,48.5
N$1
  Top 0.305: LED.C 6.8,72.05 RLED.1
N$3
  Top 0.254: T1.3 25.22,29.81 arc45 25.51,30.52 25.51,40.25 arc-90 26.83,41.57 41.22,41.57 RN1.1
N$4
  Top 0.254: 74HC595.5 47.6,45.96 RN2.7
N$5
  Top 0.254: 74HC595.6 48.51,43.35 RN2.6
N$6
  Top 0.254: T2.3 32.22,29.81 arc45 32.51,30.52 32.51,39.36 arc-90 33.72,40.57 41.38,40.57 arc90 42.1,41.29 RN1.2
N$7
  Top 0.254: 74HC595.7 49.77,43.75 RN2.5
N$8
  Top 0.305: CS1.1 RS1.2
N$9
  Top 0.305: CS2.1 RS2.2
N$10
  Top 0.254: RN2.8 45.97,44.01 74HC595.4
N$11
  Top 0.254: RN1.5 43.77,43.88 44.7,44.8 74HC595.3
N$12
  Top 0.254: RN1.6 42.9,44.5 43.42,45.02 74HC595.2
N$13
  Top 0.254: 74HC595.1 42.16,43.3 RN1.7
N$14
  Top 0.254: RN1.8 38.5,45.98 38.5,51.5 40.9,53.9 43.1,53.9 43.42,53.58 74HC595.15
N$15
  Top 0.254: RN1.3 42.9,41.03 arc-90 41.83,39.96 39.97,39.96 arc90 39.51,39.5 39.51,30.52 arc-45 39.22,29.81 T3.3
N$16
  Top 0.305: CS3.1 RS3.2
N$17
  Top 0.305: CS4.1 RS4.2
N$18
  Top 0.305: CS5.1 RS5.2
N$19
  Top 0.254: T4.3 46.22,29.81 arc45 46.51,30.52 46.51,39.8 arc90 46.01,40.3 44.3,40.3 arc-90 43.77,40.83 RN1.4
N$20
  Top 0.305: CS6.1 RS6.2
N$21
  Top 0.178: RN2.1 46.73,40.84 arc90 47.69,39.88 53.06,39.88 arc-90 53.51,39.42 53.51,30.52 arc-45 53.22,29.81 T5.3
N$22
  Top 0.305: CS7.1 RS7.2
N$23
  Top 0.305: CS8.1 RS8.2
N$24
  Top 0.508: D2.C 20.91,59.26 XL2011.5 XL2011.6
  Top 0.813: L1.P$1 14.85,57.1 18.75,57.1 D2.C
N$25
  Top 0.305: C4.2 19.62,47.92 XL2011.3
N$26
  Top 0.178: T6.3 60.22,29.81 arc45 60.51,30.52 60.51,39.59 arc90 59.77,40.33 48.3,40.33 arc-90 47.6,41.03 RN2.2
N$27
  Top 0.178: T7.3 67.51,30.1 67.51,39.58 arc90 66.27,40.82 48.8,40.82 arc-90 48.4,41.22 RN2.3
N$28
  Top 0.178: T8.3 74.41,30 74.41,40.59 arc90 73.46,41.4 49.48,41.4 RN2.4
N$33
  Top 0.254: 74HC595.14 44.7,55.22 RN3.5
N$34
  Top 0.254: 74HC595.11 48.4,52.58 48.4,55.5 48.15,55.75 RN3.8
N$35
  Top 0.254: RN3.7 47.05,55.6 47.05,52.66 74HC595.12
N$37
  Bottom 0.254: RPI.12 33.84,13.93 34.71,14.8 34.71,63.77 23.84,74.64 23.84,76.5 JP4.12
N$38
  Bottom 0.254: RPI.14 37.23,15.13 37.23,17.58 38.11,18.46 38.11,62.81 26.38,74.54 26.38,76.5 JP4.14
N$40
  Top 0.254: 74HC595.13 45.97,55.62 RN3.6 46.1,56.25 46.32,56.47 48.34,56.47 49.15,55.65 ROE.1 ROE1.2
N$41
  Bottom 0.254: JP4.23 37.81,74.78 48.32,64.27 48.32,16.87 RPI.23
N$42
  Bottom 0.254: RPI.25 51.26,16.62 52.01,17.36 52.01,63.12 40.35,74.78 JP4.25
N$43
  Bottom 0.254: RPI.27 53.8,63.82 42.89,74.73 JP4.27
N$44
  Bottom 0.254: RPI.29 56.34,17.72 55.56,18.5 55.56,64.25 45.43,74.38 JP4.29
N$45
  Bottom 0.254: JP4.39 58.28,75.23 69.04,64.47 RPI.39
N$46
  Bottom 0.254: RPI.37 66.5,63.82 55.59,74.73 JP4.37
N$47
  Bottom 0.254: RPI.17 40.55,17.02 40.55,64.27 30.19,74.63 JP4.17
N$48
  Bottom 0.254: RPI.19 43.24,16.87 43.24,29.78 42.04,30.98 42.04,64.92 32.73,74.23 JP4.19
N$49
  Bottom 0.254: RPI.21 46.18,63.57 35.27,74.48 JP4.21
N$50
  Bottom 0.254: RPI.35 63.96,20.75 62.26,22.45 62.26,65.47 53.05,74.68 JP4.35
N$51
  Bottom 0.254: RPI.33 60.9,16.99 60.9,64.19 50.51,74.58 JP4.33
N$52
  Bottom 0.254: RPI.31 58.98,16.47 59.56,17.04 59.56,62.99 47.97,74.58 JP4.31
N$53
  Bottom 0.254: RPI.34 62.68,15.19 62.68,19.57 61.63,20.62 61.63,64.69 51.78,74.54 51.78,76.5 JP4.34
N$54
  Bottom 0.254: RPI.36 65.25,15.22 65.25,20.82 63.14,22.93 63.14,65.77 54.32,74.59 54.32,76.5 JP4.36
N$55
  Bottom 0.254: RPI.38 66.8,13.93 67.71,14.84 67.71,63.86 56.86,74.71 56.86,76.8 55.89,77.77 JP4.38
N$56
  Bottom 0.254: JP4.40 58.13,77.27 70.1,65.3 70.1,14.99 RPI.40
N$59
  Bottom 0.254: RPI.18 41.1,14.07 42.4,15.37 42.4,29.11 41.41,30.1 41.41,64.54 31.46,74.49 31.46,76.5 JP4.18
N$60
  Bottom 0.254: RPI.20 43.64,14.07 44.91,15.34 44.91,63.48 34.2,74.19 34.2,76.3 JP4.20
N$61
  Bottom 0.254: RPI.22 46.24,13.93 47.45,15.14 47.45,63.73 36.54,74.64 36.54,76.85 35.62,77.77 JP4.22
N$62
  Bottom 0.254: JP4.24 38.36,77.77 39.03,77.1 39.03,74.79 49.15,64.67 49.15,18.23 49.98,17.41 49.98,14.78 49.13,13.93 RPI.24
N$63
  Bottom 0.254: RPI.26 51.26,14.07 52.65,15.46 52.65,63.61 41.62,74.64 41.62,76.9 40.75,77.77 JP4.26
N$64
  Bottom 0.254: RPI.28 53.91,13.93 54.95,14.97 54.95,63.8 44.16,74.59 44.16,76.85 43.24,77.77 JP4.28
N$65
  Bottom 0.254: RPI.30 56.4,13.93 57.56,15.09 57.56,17.61 56.24,18.93 56.24,65 46.65,74.59 46.65,76.55 JP4.30
N$66
  Bottom 0.254: RPI.32 59.09,13.93 60.16,15 60.16,63.67 49.29,74.54 49.29,76.45 JP4.32
QH*  (via drill 0.3)
  Top 0.178: 51.25,52.25 74HC595.9
  Top 0.254: v51.25,50.75 51.25,52.25 | v51.25,48.75 64,48.75 v70.75,42
  Bottom 0.254: v51.25,48.75 v51.25,50.75 | v70.75,42 70.75,33.25 75.6,28.4 75.6,13.35 80.05,8.9 82.49,8.9 EXTOUT.7
RECAC  (via drill 0.35)
  Top 0.305: C4.1 20.98,45 20.91,45.07 20.91,47.5 XL2011.4 | C6.1 8.04,45.53 C1.+
  Top 0.813: C1.+ 11.04,42 11.04,35.59 D1.C | v22,47.4 21,47.4 20.91,47.5
  Bottom 0.813: C1.+ 19.6,45 v22,47.4
RL  (via drill 0.3)
  Top 0.178: v32,19.25 32,16 31,15 31,14 RPI.10
  Bottom 0.178: v32,19.25 32,64.25 21.25,75 21.25,76.75 20.25,77.75 JP4.10 20.25,78 21.25,79 58.5,79 61,76.5 85.65,76.5 89.65,72.5 90,72.5 JP1.1
RS1  (via drill 0.3)
  Top 0.305: R1.2 19.25,10.5 20.75,12 v26.5,12
  Bottom 0.254: 28.25,13.75 RPI.8 | v26.5,12 25.4,12 24.45,12.95 24.45,14.45 23.7,15.2 22.75,15.2 22.1,15.85 22.1,17.6 21.15,18.55 21.15,32.5 23.4,34.75 23.4,62.5 13.65,72.25 13.65,78.35 14.35,79.05 15.55,79.05 16.6,78 17.25,78 JP4.8
  Bottom 0.305: 28.25,13.75 v26.5,12
RS2  (via drill 0.3)
  Top 0.305: v28,10.5 R2.2
  Bottom 0.254: JP4.16 28.92,76.5 28.92,74.54 39.82,63.64 39.82,14.88 38.87,13.93 RPI.16 38.5,13.75
  Bottom 0.305: v28,10.5 35.25,10.5 38.5,13.75
S1
  Top 0.305: 6PIN.2 16.65,6.07 R1.1
S2
  Top 0.305: 6PIN.3 21.15,5.49 R2.1
SCL  (via drill 0.3)
  Top 0.203: 55.15,64 55,64 RCL.2 | 55.15,64 56.3,64 | 56.3,64 U1.10 | U2.10 64.65,64 64.4,63.75 63.5,63.75 63,64.25 63,65.5 65.95,68.45 v65.95,68.55 | v62.3,72.2 61.1,72.2 56.3,67.4 56.3,64 | 55.15,64 54.1,65.05 44.05,65.05 v43.25,64.25 | v42.75,59 31,59 15,75 JP4.5
  Bottom 0.203: v62.3,72.2 v65.95,68.55 | v43.25,64.25 43.25,59.5 v42.75,59
  Bottom 0.254: RPI.5 25.75,16.5 25.75,64.25 15,75 JP4.5
SDA  (via drill 0.3)
  Top 0.203: U1.9 58.1,64.5 58.35,64.25 58.35,63.75 57.5,62.9 | RDA.2 52.9,63.85 53.75,63 57.5,63 57.5,62.9 | v63.75,64.5 U2.9 | v63.75,54 63.25,54 57.5,59.75 57.5,60.95 | 57.5,62.9 57.5,60.95 | v20.5,21 23.25,18.25 23.25,16.5 RPI.3 | 57.5,60.95 45.8,60.95 v44.25,62.5 | v43.25,58.25 29.25,58.25 12.5,75 JP4.3
  Bottom 0.203: v63.75,54 v63.75,64.5 | v20.5,21 20.5,44.75 22.75,47 22.75,62.5 12.5,72.75 12.5,75 JP4.3 | v44.25,62.5 44.25,59.25 v43.25,58.25
VCC  (via drill 0.3)
  Top 0.178: 55,62.25 RCL.1 | 52.6,62.25 RDA.1 | v14.25,23 20.75,16.5 RPI.1
  Top 0.305: JP6.4 JP6.3 JP6.2 JP6.1 61.9,75 59.5,72.6 49.5,72.6 41.65,64.75 | 55,62.25 52.6,62.25 45.5,62.25 44.25,63.5 42.9,63.5 41.65,64.75 | 41.65,64.75 31.45,74.95 31.45,78.45 30.9,79 16.85,79 16.2,78.35 16.2,77.15 15.5,76.45 11,76.45 9.87,75.32 JP4.1
  Bottom 0.178: v14.25,23 14.25,35.75 5.75,44.25 5.75,45.75 8.75,48.75 15,48.75 18.5,52.25 18.5,66.25 9.75,75 JP4.1
VIN
  Top 0.254: 76.75,13.25 76.7,13.2
  Top 0.305: 6PIN.4 27.14,0.6 90.6,0.6 93.7,3.7 93.7,9.7 91.9,11.5 78.4,11.5 76.7,13.2 | JP6.5 JP6.6 JP6.7 JP6.8 85.85,75 | 85.85,75 JP1.2 | 76.75,13.25 76.75,42.15 70.5,48.4 D4.A 71,51.8 76.5,57.3 76.5,65.5 78.2,67.2 82.45,67.2 85.85,70.6 85.85,75
  Top 0.61: L1.P$2 6.25,50.4 16.09,50.4 17.09,49.4 XL2011.1 17.09,45.63 19.42,43.3 24.68,43.3 30.48,49.1 D3.A
  Top 0.813: L1.P$2 2.45,63.23 C2.+ 3.72,68.67 LED.A 6.03,68.92 C0.1 | JP4.2 JP4.4 | RPI.4 RPI.2 17.43,13.93 15.1,11.6 15.1,8.5 11.7,5.1 11.7,2.4 13.1,1 21.74,1 6PIN.4
  Bottom 0.813: RPI.2 19.47,13.93 0.8,32.6 0.8,48.5 3.72,51.42 C2.+ 3.72,70.17 7.65,74.1 7.65,76.7 8.72,77.77 JP4.2
Z1  (via drill 0.35)
  Top 0.406: RS1.1 26.55,20.65
  Top 0.508: RS1.1 23.65,20.65 TVS1.A v23.5,23 | 26.55,20.65 27.17,20.03 27.17,12.75 33.72,6.19 38.51,6.19 41,3.7 JP2.1
  Top 0.813: T1.4 v22,32 T1.2
  Bottom 0.508: v23.5,23 23.5,30.5 v22,32
  pour Top (isolate 0.1, no thermals): 18.75,39.5 25.25,39.5 25.25,27.8 18.75,27.8
Z2  (via drill 0.35)
  Top 0.406: RS2.1 33.65,20.65 | JP2.2 45.45,3.5
  Top 0.508: RS2.1 30.65,20.65 TVS2.A v30.5,23 | 33.65,20.65 34.76,19.54 34.76,10.64 37,8.4 40.55,8.4 45.45,3.5
  Top 0.813: T2.4 v29,32 T2.2
  Bottom 0.508: v30.5,23 30.5,30.5 v29,32
  pour Top (isolate 0.1, no thermals): 25.75,39.5 32.25,39.5 32.25,27.8 25.75,27.8
Z3  (via drill 0.35)
  Top 0.406: JP2.3 51.12,3.54
  Top 0.508: v37.2,23 37.2,21.1 TVS3.A 37.65,20.65 RS3.1 42.38,18.77 42.38,11.85 50.69,3.54 51.12,3.54
  Top 0.813: T3.4 v36,32 T3.2
  Bottom 0.508: v37.2,23 37.2,30.8 v36,32
  pour Top (isolate 0.1, no thermals): 32.75,39.5 39.25,39.5 39.25,27.8 32.75,27.8
Z4  (via drill 0.35)
  Top 0.508: v44.1,23.05 44.1,21.2 TVS4.A 44.65,20.65 RS4.1 47.95,20.65 50,18.6 50,10.84 56.24,4.6 JP2.4
  Top 0.813: T4.4 v43,32 T4.2
  Bottom 0.508: v44.1,23.05 44.1,30.9 v43,32
  pour Top (isolate 0.1, no thermals): 39.75,39.5 46.25,39.5 46.25,27.8 39.75,27.8
Z5  (via drill 0.35)
  Top 0.508: v51,23.05 51,21.3 TVS5.A 51.65,20.65 RS5.1 55.25,20.65 57.62,18.28 57.62,10.48 61.32,6.78 JP2.5
  Top 0.813: T5.4 v50,32 T5.2
  Bottom 0.508: v51,23.05 51,31 v50,32
  pour Top (isolate 0.1, no thermals): 46.65,39.5 53.15,39.5 53.15,27.8 46.65,27.8
Z6  (via drill 0.35)
  Top 0.508: v58.5,23 TVS6.A 58.65,20.65 RS6.1 62.7,19.45 62.7,10.65 66.4,6.95 JP2.6
  Top 0.813: T6.4 v57,32 T6.2
  Bottom 0.508: v58.5,23 58.5,30.5 v57,32
  pour Top (isolate 0.1, no thermals): 53.75,39.5 60.25,39.5 60.25,27.8 53.75,27.8
Z7  (via drill 0.35)
  Top 0.508: v65.5,23 TVS7.A 65.65,20.65 RS7.1 71.48,17.67 JP2.7
  Top 0.813: T7.4 v64,32 T7.2
  Bottom 0.508: v65.5,23 65.5,30.5 v64,32
  pour Top (isolate 0.1, no thermals): 60.75,39.5 67.25,39.5 67.25,27.8 60.75,27.8
Z8  (via drill 0.35)
  Top 0.508: v72.5,23 TVS8.A 72.65,20.65 RS8.1 75.5,4.56 JP2.8
  Top 0.813: T8.4 v71,32 T8.2
  Bottom 0.508: v72.5,23 72.5,30.5 v71,32
  pour Top (isolate 0.1, no thermals): 67.75,39.5 74.25,39.5 74.25,27.8 67.75,27.8

### Text on the board
tPlace: GND | GND | +5V | 3V3 | +5V | 3V3 | RF Transmitter | DAT | OSPi v1.60 (for Raspberry Pi) | A1 A2 A3 A4 A5 A6 A7 A8 | pi.opensprinkler.com | L1 | - | + | RPi Pin Headers | 1 | Zone / Exp. | 1 2 3 4 5 6 7 8 | GND | SN1 | SN2 | +5V | COM | COM | 6PIN | S1-8